# EasyEDA Pro project 工创赛底盘主控v3_2025-03-24.epro, schematic Schematic3
Board Name: Board2_1; Create Date: 2025-03-24; Page Name: P1; Project Name: 底盘主控v3; Schematic Name: Schematic3; Update Date: 2025-03-24; Company: 嘉立创EDA; Page Size: A4; Version: V1.0
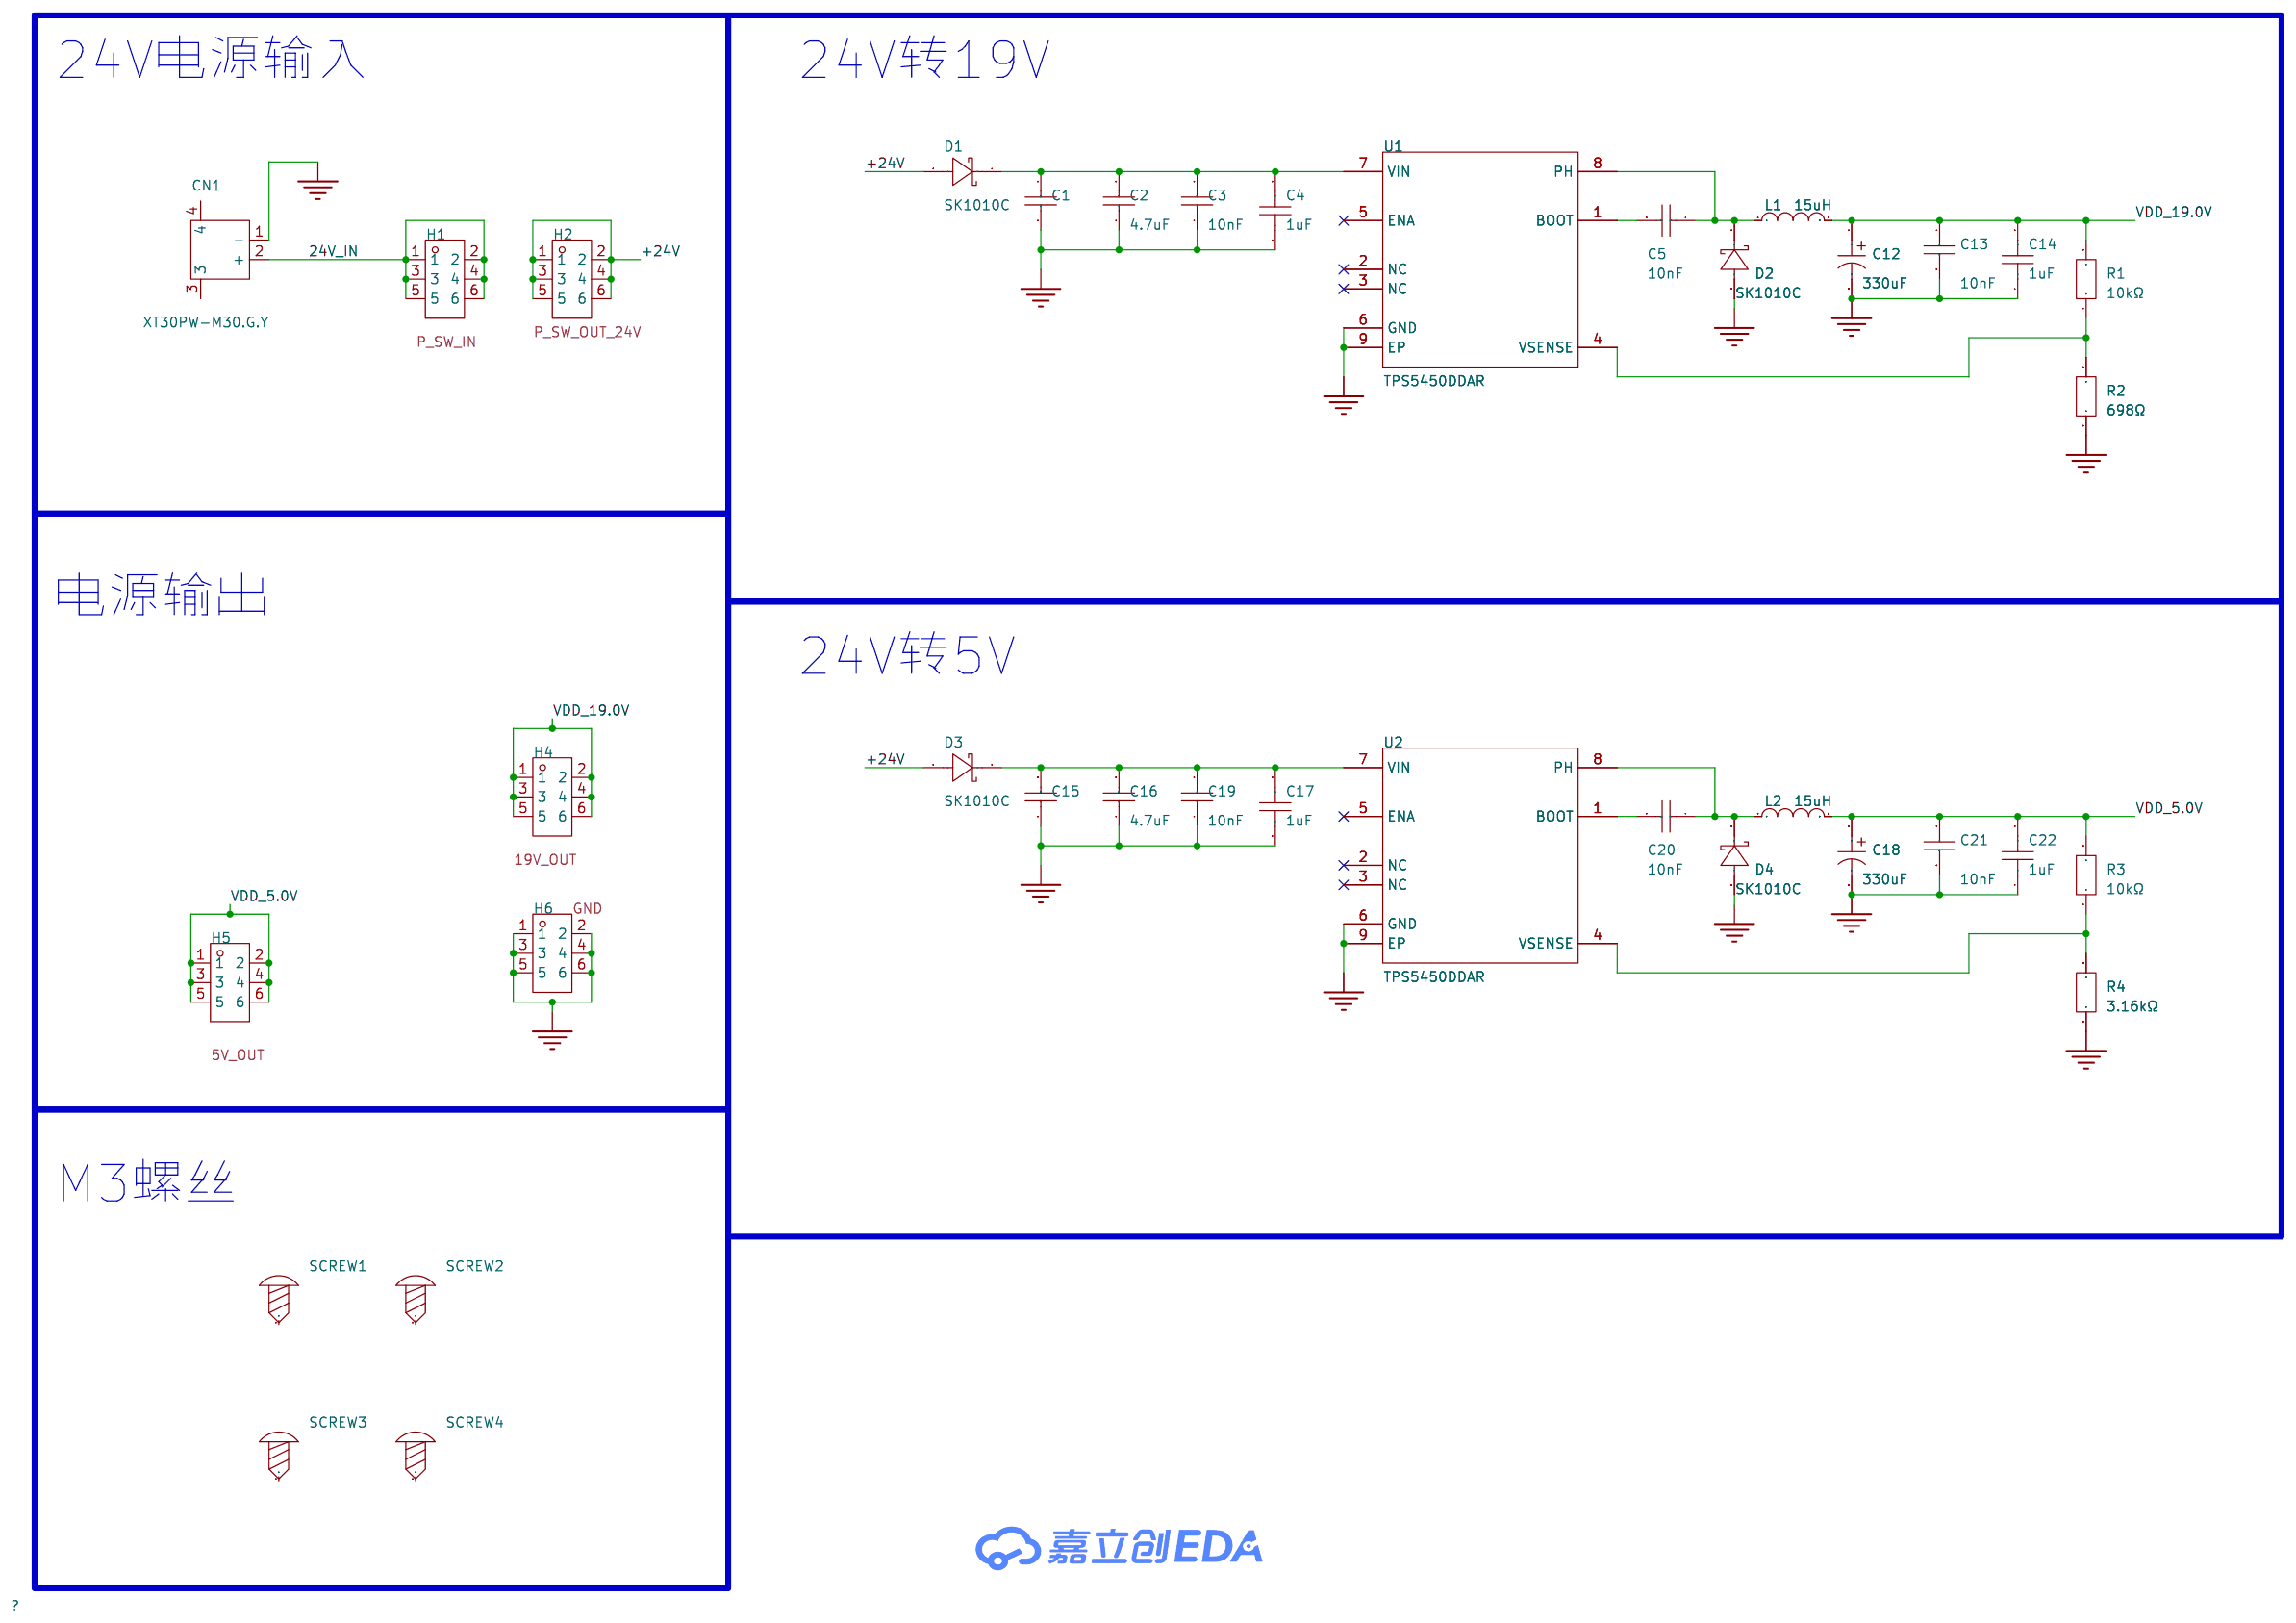
[diagram p1: schematic sheet]

## Parts
C1  4.7uF  [C1206]
C2  4.7uF  [C1206]
C3  10nF  [C1206]
C4  1uF  [C1206]
C5  10nF  [C1206]
C12  330uF  [CAP-TH_BD8.0-P3.50-D0.6-FD]
C13  10nF  [C1206]
C14  1uF  [C1206]
C15  4.7uF  [C1206]
C16  4.7uF  [C1206]
C17  1uF  [C1206]
C18  330uF  [CAP-TH_BD8.0-P3.50-D0.6-FD]
C19  10nF  [C1206]
C20  10nF  [C1206]
C21  10nF  [C1206]
C22  1uF  [C1206]
CN1  XT30PW-M30.G.Y  [CONN-TH_XT30PW-M]
D1  SK1010C  [SMC_L6.9-W5.9-LS7.9-RD]
D2  SK1010C  [SMC_L6.9-W5.9-LS7.9-RD]
D3  SK1010C  [SMC_L6.9-W5.9-LS7.9-RD]
D4  SK1010C  [SMC_L6.9-W5.9-LS7.9-RD]
H1  PM254V-12-06-H85  [HDR-TH_6P-P2.54-V-F-R2-C3-S2.54]
H2  PM254V-12-06-H85  [HDR-TH_6P-P2.54-V-F-R2-C3-S2.54]
H4  PM254V-12-06-H85  [HDR-TH_6P-P2.54-V-F-R2-C3-S2.54]
H5  PM254V-12-06-H85  [HDR-TH_6P-P2.54-V-F-R2-C3-S2.54]
H6  PM254V-12-06-H85  [HDR-TH_6P-P2.54-V-F-R2-C3-S2.54]
L1  15uH  [IND-SMD_L11.5-W10.0_FXL1040]
L2  15uH  [IND-SMD_L11.5-W10.0_FXL1040]
R1  10kΩ  [R1206]
R2  698Ω  [R1206]
R3  10kΩ  [R1206]
R4  3.16kΩ  [R1206]
SCREW1  -  [M3螺丝]
SCREW2  -  [M3螺丝]
SCREW3  -  [M3螺丝]
SCREW4  -  [M3螺丝]
U1  TPS5450DDAR  [SOP-8_L4.9-W3.9-P1.27-LS6.0-BL-EP]
U2  TPS5450DDAR  [SOP-8_L4.9-W3.9-P1.27-LS6.0-BL-EP]

## Library data of the parts
C1 C2 C15 C16 = CC1206KKX7R9BB475: 容值:4.7uF;精度:±10%;额定电压:50V;材质(温度系数):X7R;; LCSC Part Name: 4.7uF ±10% 50V; Supplier Part: C132170; Manufacturer: YAGEO(国巨); Supplier Footprint: 1206; JLCPCB Part Class: Extended Part; Datasheet: https://atta.szlcsc.com/upload/public/pdf/source/20181008/C309510_22F155564471FAF6A489F7D68F34234E.pdf; Supplier: LCSC; Tolerance: ±10%; Voltage Rated: 50V; Temperature Coefficient: X7R
C3 C5 C13 C19-C21 = CC1206JRX7R9BB103: 容值:10nF;精度:±5%;额定电压:50V;材质(温度系数):X7R;; LCSC Part Name: 10nF ±5% 50V; Supplier Part: C309501; Manufacturer: YAGEO(国巨); Supplier Footprint: 1206; JLCPCB Part Class: Extended Part; Datasheet: https://atta.szlcsc.com/upload/public/pdf/source/20181008/C309510_22F155564471FAF6A489F7D68F34234E.pdf; Supplier: LCSC; Tolerance: ±5%; Voltage Rated: 50V; Temperature Coefficient: X7R
C4 C14 C17 C22 = CC1206KKX7R0BB105: 容值:1uF;精度:±10%;额定电压:100V;材质(温度系数):X7R;; LCSC Part Name: 1uF ±10% 100V; Supplier Part: C70463; Manufacturer: YAGEO(国巨); Supplier Footprint: 1206; JLCPCB Part Class: Extended Part; Datasheet: https://atta.szlcsc.com/upload/public/pdf/source/20180906/C282243_51A53A5345E69C6665D4E8CFC2B98E68.pdf; Supplier: LCSC; Tolerance: ±10%; Voltage Rated: 100V; Temperature Coefficient: X7R
C12 C18 = SPT1EM331F09OR: 容值:330uF;精度:±20%;额定电压:25V;纹波电流:-;等效串联电阻:-;类型:-;; LCSC Part Name: 330uF ±20% 25V; Supplier Part: C697705; Manufacturer: Yunxing(云星); Supplier Footprint: 插件,D8xL9mm; JLCPCB Part Class: Extended Part; Datasheet: https://atta.szlcsc.com/upload/public/pdf/source/20200709/C697725_42901235359D2F905A7BBBDFFA1D5D23.pdf; Supplier: LCSC; Tolerance: ±20%; Rated Voltage: 25V; Lead Spacing: 3.5mm; φD: 8mm; L: 9mm; Lifetime @ Temp: 2000hrs@105℃; Operating Temperature: -55℃~+105℃
CN1 = XT30PW-M30.G.Y: 类别:-;类型1:-;; LCSC Part Name: AMASS(艾迈斯)航模插头 卧式弯脚 XT30PW-M公头; Supplier Part: C431092; Manufacturer: AMASS(艾迈斯); JLCPCB Part Class: Extended Part; Datasheet: https://atta.szlcsc.com/upload/public/pdf/source/20220222/6A9F22F7850E25B33E1BE430ADF8560B.pdf; Supplier: LCSC; Type: 航模插头; RatedVoltage: DC 500V; InterfaceType: 公头; RatedCurrent: 15A; RecommendedWireGauge: 16/18/20AWG; contact resistance: 1.2mΩ; specifications: 2pin
D1-D4 = SK1010C_C18199193: 二极管配置:独立式;正向压降(Vf):850mV@10A;直流反向耐压(Vr):100V;整流电流:10A;; LCSC Part Name: 电压:100V 电流:10A; Supplier Part: C18199193; Manufacturer: 宏迦橙; Supplier Footprint: SMC; JLCPCB Part Class: Extended Part; Datasheet: https://atta.szlcsc.com/upload/public/pdf/source/20230925/90F2340DC9BC2B2517F18AABBBD1A464.pdf; Supplier: LCSC; Diode Configuration: 独立式; Forward Voltage (Vf@If): 850mV@10A; Reverse Voltage (Vr): 100V; Rectified Current: 10A; Reverse Leakage Current (Ir): 50uA@100V
H1 = PM254V-12-06-H85: 插孔结构:2x3P;间距:2.54mm;行距:2.54mm;安装类型:直插;排数:双排;总孔位数:6P;塑高:-;触头材质:黄铜;触头镀层:-;; LCSC Part Name: 间距:2.54mm 2x3P 直插; Supplier Part: C541853; Manufacturer: XFCN(兴飞); Supplier Footprint: 插件,P=2.54mm; JLCPCB Part Class: Extended Part; Datasheet: https://atta.szlcsc.com/upload/public/pdf/source/20200309/C492399_8C441E2934FBB604A89B37A68AA45ECF.pdf; Supplier: LCSC; Holes Structure: 2x3P; Pitch: 2.54mm; Row Spacing: 2.54mm; Mounting Type: 直插; Number of Rows: 双排; Number of Holes: 6P; Contact Material: 黄铜; Comment: P_SW_IN
H2 = PM254V-12-06-H85: 插孔结构:2x3P;间距:2.54mm;行距:2.54mm;安装类型:直插;排数:双排;总孔位数:6P;塑高:-;触头材质:黄铜;触头镀层:-;; LCSC Part Name: 间距:2.54mm 2x3P 直插; Supplier Part: C541853; Manufacturer: XFCN(兴飞); Supplier Footprint: 插件,P=2.54mm; JLCPCB Part Class: Extended Part; Datasheet: https://atta.szlcsc.com/upload/public/pdf/source/20200309/C492399_8C441E2934FBB604A89B37A68AA45ECF.pdf; Supplier: LCSC; Holes Structure: 2x3P; Pitch: 2.54mm; Row Spacing: 2.54mm; Mounting Type: 直插; Number of Rows: 双排; Number of Holes: 6P; Contact Material: 黄铜; Comment: P_SW_OUT_24V
H4 = PM254V-12-06-H85: 插孔结构:2x3P;间距:2.54mm;行距:2.54mm;安装类型:直插;排数:双排;总孔位数:6P;塑高:-;触头材质:黄铜;触头镀层:-;; LCSC Part Name: 间距:2.54mm 2x3P 直插; Supplier Part: C541853; Manufacturer: XFCN(兴飞); Supplier Footprint: 插件,P=2.54mm; JLCPCB Part Class: Extended Part; Datasheet: https://atta.szlcsc.com/upload/public/pdf/source/20200309/C492399_8C441E2934FBB604A89B37A68AA45ECF.pdf; Supplier: LCSC; Holes Structure: 2x3P; Pitch: 2.54mm; Row Spacing: 2.54mm; Mounting Type: 直插; Number of Rows: 双排; Number of Holes: 6P; Contact Material: 黄铜; Comment: 19V_OUT
H5 = PM254V-12-06-H85: 插孔结构:2x3P;间距:2.54mm;行距:2.54mm;安装类型:直插;排数:双排;总孔位数:6P;塑高:-;触头材质:黄铜;触头镀层:-;; LCSC Part Name: 间距:2.54mm 2x3P 直插; Supplier Part: C541853; Manufacturer: XFCN(兴飞); Supplier Footprint: 插件,P=2.54mm; JLCPCB Part Class: Extended Part; Datasheet: https://atta.szlcsc.com/upload/public/pdf/source/20200309/C492399_8C441E2934FBB604A89B37A68AA45ECF.pdf; Supplier: LCSC; Holes Structure: 2x3P; Pitch: 2.54mm; Row Spacing: 2.54mm; Mounting Type: 直插; Number of Rows: 双排; Number of Holes: 6P; Contact Material: 黄铜; Comment: 5V_OUT
H6 = PM254V-12-06-H85: 插孔结构:2x3P;间距:2.54mm;行距:2.54mm;安装类型:直插;排数:双排;总孔位数:6P;塑高:-;触头材质:黄铜;触头镀层:-;; LCSC Part Name: 间距:2.54mm 2x3P 直插; Supplier Part: C541853; Manufacturer: XFCN(兴飞); Supplier Footprint: 插件,P=2.54mm; JLCPCB Part Class: Extended Part; Datasheet: https://atta.szlcsc.com/upload/public/pdf/source/20200309/C492399_8C441E2934FBB604A89B37A68AA45ECF.pdf; Supplier: LCSC; Holes Structure: 2x3P; Pitch: 2.54mm; Row Spacing: 2.54mm; Mounting Type: 直插; Number of Rows: 双排; Number of Holes: 6P; Contact Material: 黄铜; Comment: GND
L1 L2 = FXL1040-150-M: 电感值:15uH;精度:±20%;额定电流:6.5A;饱和电流(Isat):7A;类型:一体成型电感;; LCSC Part Name: 15uH ±20% 7A; Supplier Part: C475916; Manufacturer: cjiang(长江微电); Supplier Footprint: SMD,11.5x10mm; JLCPCB Part Class: 扩展库; Datasheet: https://atta.szlcsc.com/upload/public/pdf/source/20230516/54757DC4DB76FADFA619F78143C06647.pdf; Supplier: LCSC; Tolerance: ±20%; Rated Current: 6.5A; Saturation Current (Isat): 7A; DC Resistance (DCR): 45mΩ; Type: 一体成型电感
R1 R3 = RT1206FRD0710KL: 电阻类型:薄膜电阻;阻值:10kΩ;精度:±1%;功率:250mW;最大工作电压:200V;温度系数:±25ppm/℃;; LCSC Part Name: 薄膜电阻 10kΩ ±1% 250mW; Supplier Part: C705072; Manufacturer: YAGEO(国巨); Supplier Footprint: 1206; JLCPCB Part Class: Extended Part; Datasheet: https://atta.szlcsc.com/upload/public/pdf/source/20200720/C705072_3B769B5B2AA04FFA8AAD19B47DEA9A37.pdf; Supplier: LCSC; Type: 薄膜电阻; Tolerance: ±1%; Power(Watts): 250mW; Overload Voltage (Max): 200V; Temperature Coefficient: ±25ppm/℃; Operating Temperature Range: -55℃~+155℃
R2 = RC1206FR-07698RL: 电阻类型:厚膜电阻;阻值:698Ω;精度:±1%;功率:250mW;最大工作电压:200V;温度系数:±100ppm/℃;; LCSC Part Name: 厚膜电阻 698Ω ±1% 250mW; Supplier Part: C274041; Manufacturer: YAGEO(国巨); Supplier Footprint: 1206; JLCPCB Part Class: Extended Part; Datasheet: https://atta.szlcsc.com/upload/public/pdf/source/20191125/C364360_EA870FADD46A2AD4DBE56DD50D360B3E.pdf; Supplier: LCSC; Type: 厚膜电阻; Tolerance: ±1%; Power(Watts): 250mW; Overload Voltage (Max): 200V; Temperature Coefficient: ±100ppm/℃; Operating Temperature Range: -55℃~+155℃
R4 = RT1206BRD073K16L: 电阻类型:薄膜电阻;阻值:3.16kΩ;精度:±0.1%;功率:250mW;温度系数:±25ppm/℃;; LCSC Part Name: 薄膜电阻 3.16kΩ ±0.1% 250mW; Supplier Part: C870706; Manufacturer: YAGEO(国巨); Supplier Footprint: 1206; JLCPCB Part Class: Extended Part; Datasheet: https://atta.szlcsc.com/upload/public/pdf/source/20200610/C326738_5639A9F1B6EB6E4AE2197577D3456E7F.pdf; Supplier: LCSC; Type: 薄膜电阻; Tolerance: ±0.1%; Power(Watts): 250mW; Temperature Coefficient: ±25ppm/℃; Operating Temperature Range: -55℃~+155℃
SCREW1-SCREW4 = M3螺丝: Supplier Footprint: 插件
U1 U2 = TPS5450DDAR: 功能类型:降压型;输出类型:可调;输入电压:5.5V~36V;输出电压:1.221V~31.32V;输出电流(最大值):5A;; Supplier Part: C114425; Manufacturer: TI(德州仪器); Supplier Footprint: SOP-8-EP-150mil; JLCPCB Part Class: 扩展库; Datasheet: https://www.ti.com/cn/lit/gpn/tps5450; Supplier: LCSC; Function: 降压型; Output Type: 可调; Input Voltage: 5.5V~36V; Output Voltage: 1.221V~31.32V; Output Current (Max): 5A; Switching Frequency: 500kHz; Operating Temperature: -40℃~+125℃@(TJ); Synchronous Rectification: 否; Number of Outputs: 1; Topology: 降压式; Switch tube (built-in/external): 内置

## Nets
24V_IN: CN1.2(+) H1.1 H1.2 H1.3 H1.4 H1.5 H1.6
+24V: D1.2(A) D3.2(A) H2.1 H2.2 H2.3 H2.4 H2.5 H2.6
GND: C1.1 C2.1 C3.1 C4.1 C12.2 C13.2 C14.1 C15.1 C16.1 C17.1 C18.2 C19.1 C21.2 C22.1 CN1.1(-) D2.2(A) D4.2(A) H6.1 H6.2 H6.3 H6.4 H6.5 H6.6 R2.1 R4.1 U1.6(GND) U1.9(EP) U2.6(GND) U2.9(EP)
VDD_5.0V: C18.1 C21.1 C22.2 H5.1 H5.2 H5.3 H5.4 H5.5 H5.6 L2.2 R3.2
VDD_19.0V: C12.1 C13.1 C14.2 H4.1 H4.2 H4.3 H4.4 H4.5 H4.6 L1.2 R1.2
$1N1659: C1.2 C2.2 C3.2 C4.2 D1.1(K) U1.7(VIN)
$1N1662: C5.2 U1.1(BOOT)
$1N1663: C5.1 D2.1(K) L1.1 U1.8(PH)
$1N1670: R1.1 R2.2 U1.4(VSENSE)
$1N1672: C15.2 C16.2 C17.2 C19.2 D3.1(K) U2.7(VIN)
$1N1675: C20.2 U2.1(BOOT)
$1N1676: C20.1 D4.1(K) L2.1 U2.8(PH)
$1N1683: R3.1 R4.2 U2.4(VSENSE)

Not connected (* = marked no-connect by the designer): CN1 3 4; SCREW1 1; SCREW2 1; SCREW3 1; SCREW4 1; U1 2(NC)* 3(NC)* 5(ENA)*; U2 2(NC)* 3(NC)* 5(ENA)*

## Notes on the sheet
- 24V电源输入
- 24V转19V
- 电源输出
- 24V转5V
- M3螺丝
